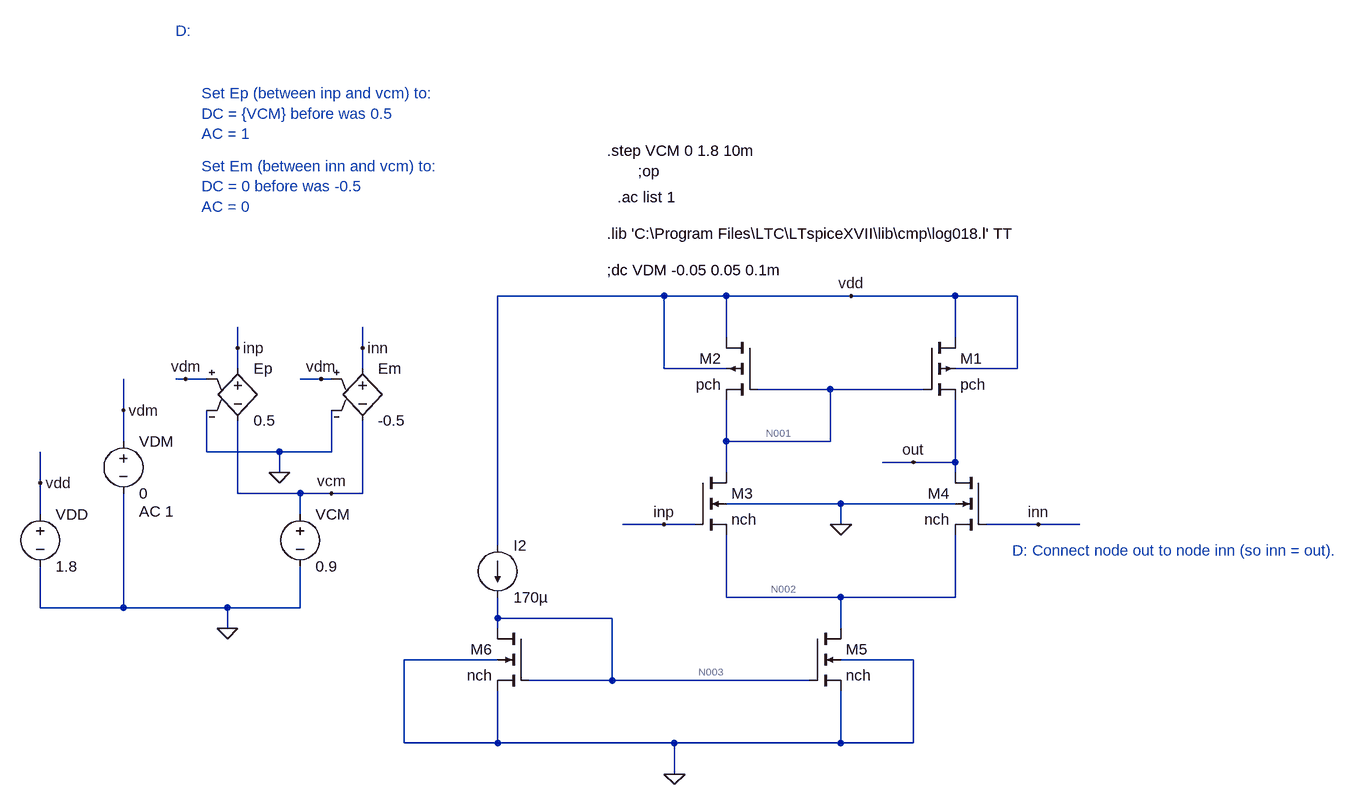
[diagram p0: schematic Week4_Ex2.asc]
Week4_Ex2.asc, the LTspice schematic file:
Version 4
SHEET 1 2388 852
WIRE 1072 96 816 96
WIRE 1168 96 1072 96
WIRE 1360 96 1168 96
WIRE 1520 96 1360 96
WIRE 1616 96 1520 96
WIRE 1168 160 1168 96
WIRE 1520 160 1520 96
WIRE 416 176 416 144
WIRE 608 176 608 144
WIRE 416 208 416 176
WIRE 608 208 608 176
WIRE 1072 208 1072 96
WIRE 1168 208 1072 208
WIRE 1616 208 1616 96
WIRE 1616 208 1520 208
WIRE 336 224 320 224
WIRE 368 224 336 224
WIRE 544 224 512 224
WIRE 560 224 544 224
WIRE 1328 240 1216 240
WIRE 1472 240 1328 240
WIRE 240 272 240 224
WIRE 240 320 240 272
WIRE 1168 320 1168 256
WIRE 1328 320 1328 240
WIRE 1328 320 1168 320
WIRE 368 336 368 272
WIRE 480 336 368 336
WIRE 560 336 560 272
WIRE 560 336 480 336
WIRE 1456 352 1408 352
WIRE 1520 352 1520 256
WIRE 1520 352 1456 352
WIRE 480 368 480 336
WIRE 1168 368 1168 320
WIRE 1520 368 1520 352
WIRE 112 384 112 336
WIRE 416 400 416 288
WIRE 512 400 416 400
WIRE 560 400 512 400
WIRE 608 400 608 288
WIRE 608 400 560 400
WIRE 1344 416 1168 416
WIRE 1520 416 1344 416
WIRE 112 432 112 384
WIRE 512 432 512 400
WIRE 1072 448 1008 448
WIRE 1120 448 1072 448
WIRE 1344 448 1344 416
WIRE 1648 448 1568 448
WIRE 1712 448 1648 448
WIRE 816 480 816 96
WIRE 1168 560 1168 464
WIRE 1344 560 1168 560
WIRE 1520 560 1520 464
WIRE 1520 560 1344 560
WIRE 112 576 112 512
WIRE 240 576 240 400
WIRE 240 576 112 576
WIRE 400 576 240 576
WIRE 512 576 512 512
WIRE 512 576 400 576
WIRE 816 592 816 560
WIRE 992 592 816 592
WIRE 400 608 400 576
WIRE 816 608 816 592
WIRE 1344 608 1344 560
WIRE 816 656 672 656
WIRE 1456 656 1344 656
WIRE 992 688 992 592
WIRE 992 688 864 688
WIRE 1296 688 992 688
WIRE 672 784 672 656
WIRE 816 784 816 704
WIRE 816 784 672 784
WIRE 1088 784 816 784
WIRE 1344 784 1344 704
WIRE 1344 784 1088 784
WIRE 1456 784 1456 656
WIRE 1456 784 1344 784
WIRE 1088 832 1088 784
FLAG 400 608 0
FLAG 112 384 vdd
FLAG 416 176 inp
FLAG 608 176 inn
FLAG 480 368 0
FLAG 336 224 vdm
FLAG 544 224 vdm
FLAG 240 272 vdm
FLAG 560 400 vcm
FLAG 1072 448 inp
FLAG 1648 448 inn
FLAG 1456 352 out
FLAG 1360 96 vdd
FLAG 1344 448 0
FLAG 1088 832 0
SYMBOL voltage 512 416 R0
WINDOW 123 0 0 Left 0
WINDOW 39 0 0 Left 0
SYMATTR InstName VCM
SYMATTR Value 0.9
SYMBOL voltage 112 416 R0
WINDOW 123 0 0 Left 0
WINDOW 39 0 0 Left 0
SYMATTR InstName VDD
SYMATTR Value 1.8
SYMBOL e 416 192 R0
SYMATTR InstName Ep
SYMATTR Value 0.5
SYMBOL voltage 240 304 R0
WINDOW 123 24 124 Left 2
WINDOW 39 0 0 Left 0
SYMATTR Value2 AC 1
SYMATTR InstName VDM
SYMATTR Value 0
SYMBOL e 608 192 R0
SYMATTR InstName Em
SYMATTR Value -0.5
SYMBOL nmos4 1120 368 R0
SYMATTR InstName M3
SYMATTR Value nch
SYMATTR Value2 l=1u w=20u
SYMBOL nmos4 1568 368 M0
SYMATTR InstName M4
SYMATTR Value nch
SYMATTR Value2 l=1u w=20u
SYMBOL pmos4 1472 160 R0
SYMATTR InstName M1
SYMATTR Value pch
SYMATTR Value2 l=1u w=40u
SYMBOL pmos4 1216 160 M0
SYMATTR InstName M2
SYMATTR Value pch
SYMATTR Value2 l=1u w=40u
SYMBOL current 816 480 R0
WINDOW 123 0 0 Left 0
WINDOW 39 0 0 Left 0
SYMATTR InstName I2
SYMATTR Value 170µ
SYMBOL nmos4 1296 608 R0
SYMATTR InstName M5
SYMATTR Value nch
SYMATTR Value2 l=1u w=40u
SYMBOL nmos4 864 608 M0
SYMATTR InstName M6
SYMATTR Value nch
SYMATTR Value2 l=1u w=40u
TEXT 984 0 Left 2 !.lib 'C:\\Program Files\\LTC\\LTspiceXVII\\lib\\cmp\\log018.l' TT
TEXT 984 56 Left 2 !;dc VDM -0.05 0.05 0.1m
TEXT 1000 -56 Left 2 !.ac list 1
TEXT 1032 -96 Left 2 !;op
TEXT 984 -128 Left 2 !.step VCM 0 1.8 10m
TEXT 1608 488 Left 2 ;D: Connect node out to node inn (so inn = out).
TEXT 360 -216 Left 2 ;Set Ep (between inp and vcm) to:\nDC = {VCM} before was 0.5\nAC = 1
TEXT 320 -312 Left 2 ;D:
TEXT 360 -104 Left 2 ;Set Em (between inn and vcm) to:\nDC = 0 before was -0.5\nAC = 0

The netlist it stands for:
* Week4_Ex2.asc
VCM vcm 0 0.9
VDD vdd 0 1.8
Ep inp vcm vdm 0 0.5
VDM vdm 0 0 AC 1
Em inn vcm vdm 0 -0.5
M3 N001 inp N002 0 nch l=1u w=20u
M4 out inn N002 0 nch l=1u w=20u
M1 vdd N001 out vdd pch l=1u w=40u
M2 vdd N001 N001 vdd pch l=1u w=40u
I2 vdd N003 170µ
M5 N002 N003 0 0 nch l=1u w=40u
M6 N003 N003 0 0 nch l=1u w=40u
.model NMOS NMOS
.model PMOS PMOS
.lib standard.mos
.lib 'C:\Program Files\LTC\LTspiceXVII\lib\cmp\log018.l' TT
;dc VDM -0.05 0.05 0.1m
.ac list 1
;op
.step VCM 0 1.8 10m
* D: Connect node out to node inn (so inn = out).
* Set Ep (between inp and vcm) to:
* DC = {VCM} before was 0.5
* AC = 1
* D:
* Set Em (between inn and vcm) to:
* DC = 0 before was -0.5
* AC = 0
.backanno
.end

* Results of the author's LTspice run, read from the files saved beside the schematic
* Operating Point (first step), zero values left out:
*   V(vdd) = 1.8 V
*   V(n001) = 1.752 V
*   V(n002) = 42.61 nV
*   V(out) = 1.752 V
*   V(n003) = 599.5 mV
*   Id(M2) = 41.96 pA
*   Is(M2) = -42.01 pA
*   Id(M1) = 41.96 pA
*   Is(M1) = -42.01 pA
*   Id(M6) = 170 µA
*   Is(M6) = -170 µA
*   Id(M5) = 80.42 pA
*   Is(M5) = -80.42 pA
*   Id(M4) = 42.01 pA
*   Ib(M4) = -1.796 pA
*   Is(M4) = -40.21 pA
*   Id(M3) = 42.01 pA
*   Ib(M3) = -1.796 pA
*   Is(M3) = -40.21 pA
*   I(I2) = 170 µA
*   I(Vdd) = -170 µA
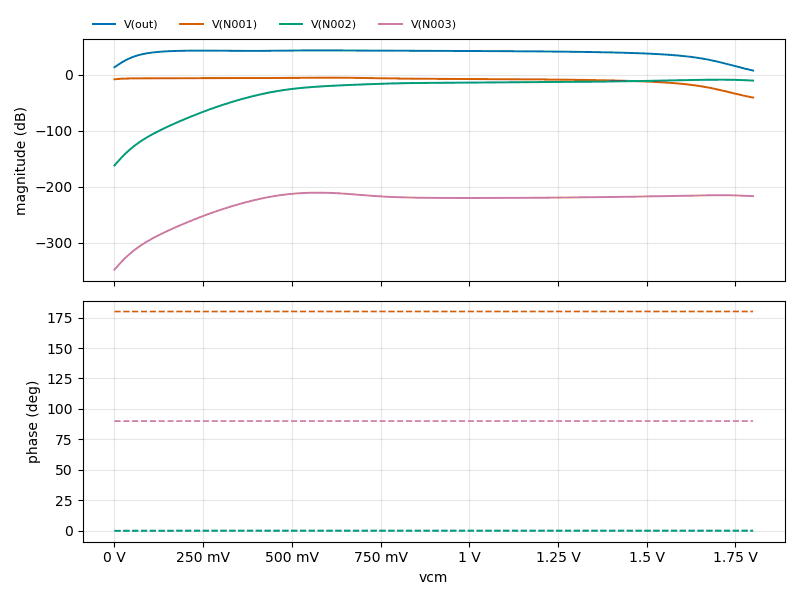
[diagram p1: AC Analysis of Week4_Ex2.asc, plotted from the saved traces]
* AC Analysis, 1 run:
*   V(out): 13.49 dB at 0 Hz, 7.58 dB at 1.8 Hz, peak 43.60 dB at 570 mHz, 3 dB below the peak at 117 mHz and 1.354 Hz
*   V(N001): -8.01 dB at 0 Hz, -40.69 dB at 1.8 Hz, peak -5.15 dB at 580 mHz, 3 dB below the peak at 1.169 Hz
*   V(N002): -162.13 dB at 0 Hz, -10.39 dB at 1.8 Hz, peak -8.71 dB at 1.7 Hz, 3 dB below the peak at 1.425 Hz
*   V(N003): -348.45 dB at 0 Hz, -216.99 dB at 1.8 Hz, peak -210.73 dB at 570 mHz, 3 dB below the peak at 486 mHz and 673.5 mHz